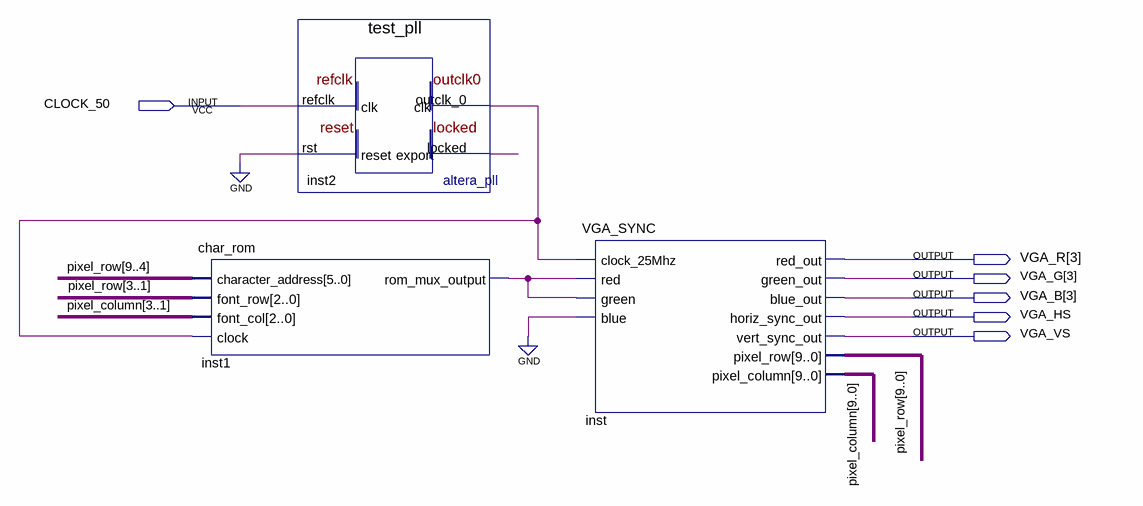
[diagram p0: schematic sheet]
// Quartus schematic TextTest.bdf as structural Verilog: 3 symbols, 6 pins
module TextTest (
  input  CLOCK_50,
  output [3:3] VGA_R,
  output [3:3] VGA_G,
  output [3:3] VGA_B,
  output VGA_HS,
  output VGA_VS
);

  wire inst1_rom_mux_output, inst2_locked, inst2_outclk_0;
  wire [9:0] pixel_column, pixel_row;

  char_rom inst1 (
    .character_address(pixel_row[9:4]), .font_row(pixel_row[3:1]), .font_col(pixel_column[3:1]),
    .clock(inst2_outclk_0), .rom_mux_output(inst1_rom_mux_output));
  test_pll inst2 (.refclk(CLOCK_50), .rst(1'b0), .outclk_0(inst2_outclk_0), .locked(inst2_locked));
  VGA_SYNC inst (
    .clock_25Mhz(inst2_outclk_0), .red(inst1_rom_mux_output), .green(inst1_rom_mux_output), .blue(1'b0),
    .red_out(VGA_R[3]), .green_out(VGA_G[3]), .blue_out(VGA_B[3]), .horiz_sync_out(VGA_HS),
    .vert_sync_out(VGA_VS), .pixel_row(pixel_row), .pixel_column(pixel_column));
endmodule
